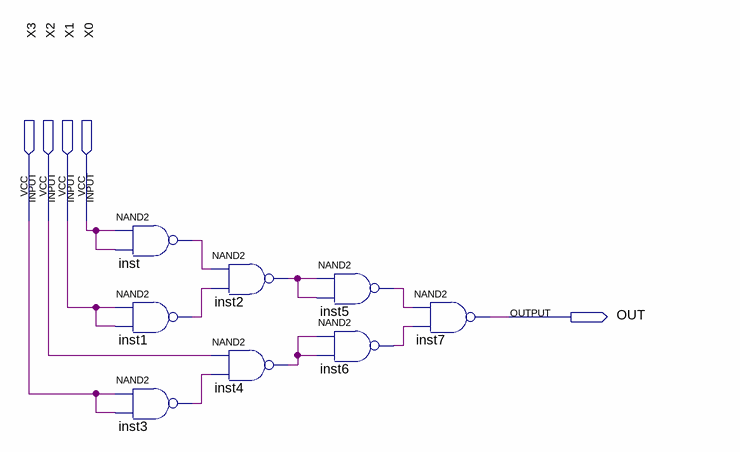
[diagram p0: schematic sheet]
// Quartus schematic C.bdf as structural Verilog: 8 symbols, 5 pins
module C (
  input  X3,
  input  X2,
  input  X1,
  input  X0,
  output OUT
);

  wire inst1_out, inst2_out, inst3_out, inst4_out, inst5_out, inst6_out, inst_out;

  nand inst (inst_out, X0, X0);
  nand inst1 (inst1_out, X1, X1);
  nand inst3 (inst3_out, X3, X3);
  nand inst2 (inst2_out, inst_out, inst1_out);
  nand inst4 (inst4_out, X2, inst3_out);
  nand inst5 (inst5_out, inst2_out, inst2_out);
  nand inst6 (inst6_out, inst4_out, inst4_out);
  nand inst7 (OUT, inst5_out, inst6_out);
endmodule
